# EAGLE schematic mainboard (EAGLE 6.6.0)

## Sheet 1 of 3: Avionics
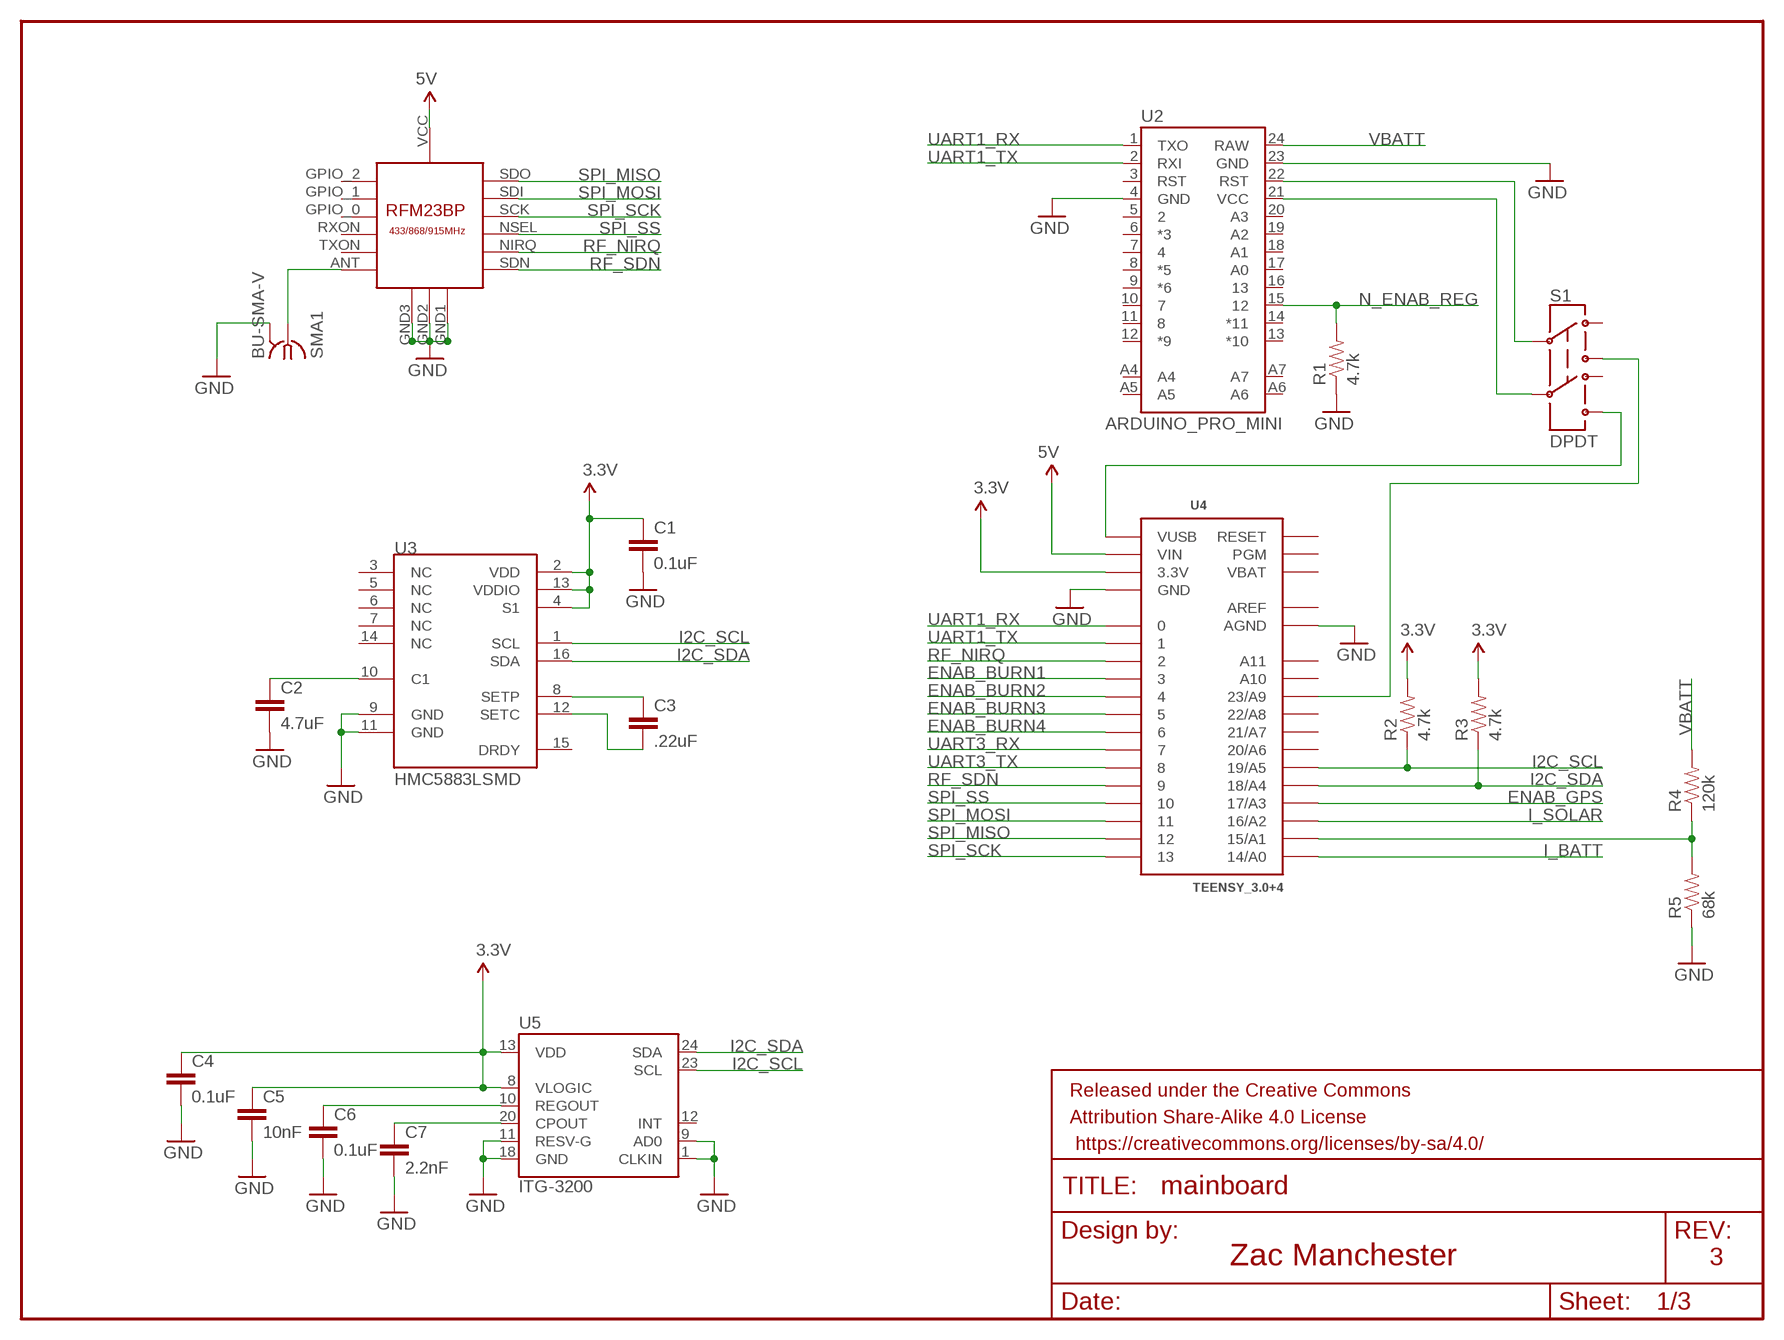
[diagram p0: schematic, sheet 1]

### Parts
C1  0.1uF  CAP0805  [0805]
C2  4.7uF  CAP0805  [0805]
C3  .22uF  CAP0805  [0805]
C4  0.1uF  CAP0805  [0805]
C5  10nF  CAP0805  [0805]
C6  0.1uF  CAP0805  [0805]
C7  2.2nF  CAP0805  [0805]
FRAME1  FRAME-LETTER  [CREATIVE_COMMONS]
R1  4.7k  RESISTOR0805-RES  [0805]
R2  4.7k  RESISTOR0805-RES  [0805]
R3  4.7k  RESISTOR0805-RES  [0805]
R4  120k  RESISTOR0805-RES  [0805]
R5  68k  RESISTOR0805-RES  [0805]
S1  DPDT  SWITCH-DPDTAYZ0202  [AYZ0202]
SMA1  BU-SMA-V  [BU-SMA-V]
U1  RFM23BP  [RFM23BP]
U2  ARDUINO_PRO_MINI  [ARDUINO_PRO_MINI]
U3  HMC5883LSMD  [16LPCC]
U4  TEENSY_3.0+4  [TEENSY_3.0+4]
U5  ITG-3200  [QFN-24]

### Nets
3.3V: C1.1 C4.1 C5.1 R2.2 R3.2 U3.2(VDD) U3.4(S1) U3.13(VDDIO) U4.3.3V U4.3.3V1(3.3V) U5.8(VLOGIC) U5.13(VDD) ; also sheet 2
5V: U1.VCC U4.VIN ; also sheet 2
ENAB_BURN1: U4.3 ; also sheet 2
ENAB_BURN2: U4.4 ; also sheet 2
ENAB_BURN3: U4.5 ; also sheet 2
ENAB_BURN4: U4.6 ; also sheet 2
ENAB_GPS: U4.17/A3 ; also sheet 2
GND: C1.2 C2.2 C4.2 C5.2 C6.2 C7.2 R1.1 R5.1 SMA1.2 SMA1.3 SMA1.4 SMA1.5 U1.GND1 U1.GND2 U1.GND3 U2.4(GND) U2.23(GND) U3.9(GND) U3.11(GND) U4.AGND U4.GND U4.GND1(GND) U5.1(CLKIN) U5.9(AD0) U5.11(RESV-G) U5.18(GND) ; also sheet 2,3
I2C_SCL: R2.1 U3.1(SCL) U4.19/A5 U5.23(SCL)
I2C_SDA: R3.1 U3.16(SDA) U4.18/A4 U5.24(SDA)
I_BATT: U4.14/A0 ; also sheet 2
I_SOLAR: U4.16/A2 ; also sheet 2
N$11: S1.3 U4.23/A9
N$13: S1.6 U4.VUSB
N$19: SMA1.1 U1.ANT
N$37: R4.1 R5.2 U4.15/A1
N$39: C7.1 U5.20(CPOUT)
N$40: C6.1 U5.10(REGOUT)
N$42: C2.1 U3.10(C1)
N$43: C3.1 U3.8(SETP)
N$44: C3.2 U3.12(SETC)
N_ENAB_REG: R1.2 U2.15 ; also sheet 2
PGM_RST: S1.2 U2.22(RST)
PGM_VCC: S1.5 U2.21(VCC)
RF_NIRQ: U1.NIRQ U4.2
RF_SDN: U1.SDN U4.9
SPI_MISO: U1.SDO U4.12
SPI_MOSI: U1.SDI U4.11
SPI_SCK: U1.SCK U4.13
SPI_SS: U1.NSEL U4.10
UART1_RX: U2.1(TXO) U4.0
UART1_TX: U2.2(RXI) U4.1
UART3_RX: U4.7 ; also sheet 3
UART3_TX: U4.8 ; also sheet 3
VBATT: R4.2 U2.24(RAW) ; also sheet 2,3
Unconnected: S1.1 S1.4 U1.GPIO_0 U1.GPIO_1 U1.GPIO_2 U1.RXON U1.TXON U2.3(RST) U2.5 U2.6(*3) U2.7 U2.8(*5) U2.9(*6) U2.10 U2.11 U2.12(*9) U2.13(*10) U2.14(*11) U2.16 U2.17(A0) U2.18(A1) U2.19(A2) U2.20(A3) U2.A4 U2.A5 U2.A6 U2.A7 U3.3(NC) U3.5(NC) U3.6(NC) U3.7(NC) U3.14(NC) U3.15(DRDY) U4.20/A6 U4.21/A7 U4.22/A8 U4.A10 U4.A11 U4.PGM U4.RESET U5.12(INT)

### Notes on the sheet
- Zac Manchester | 3

## Sheet 2 of 3: Power
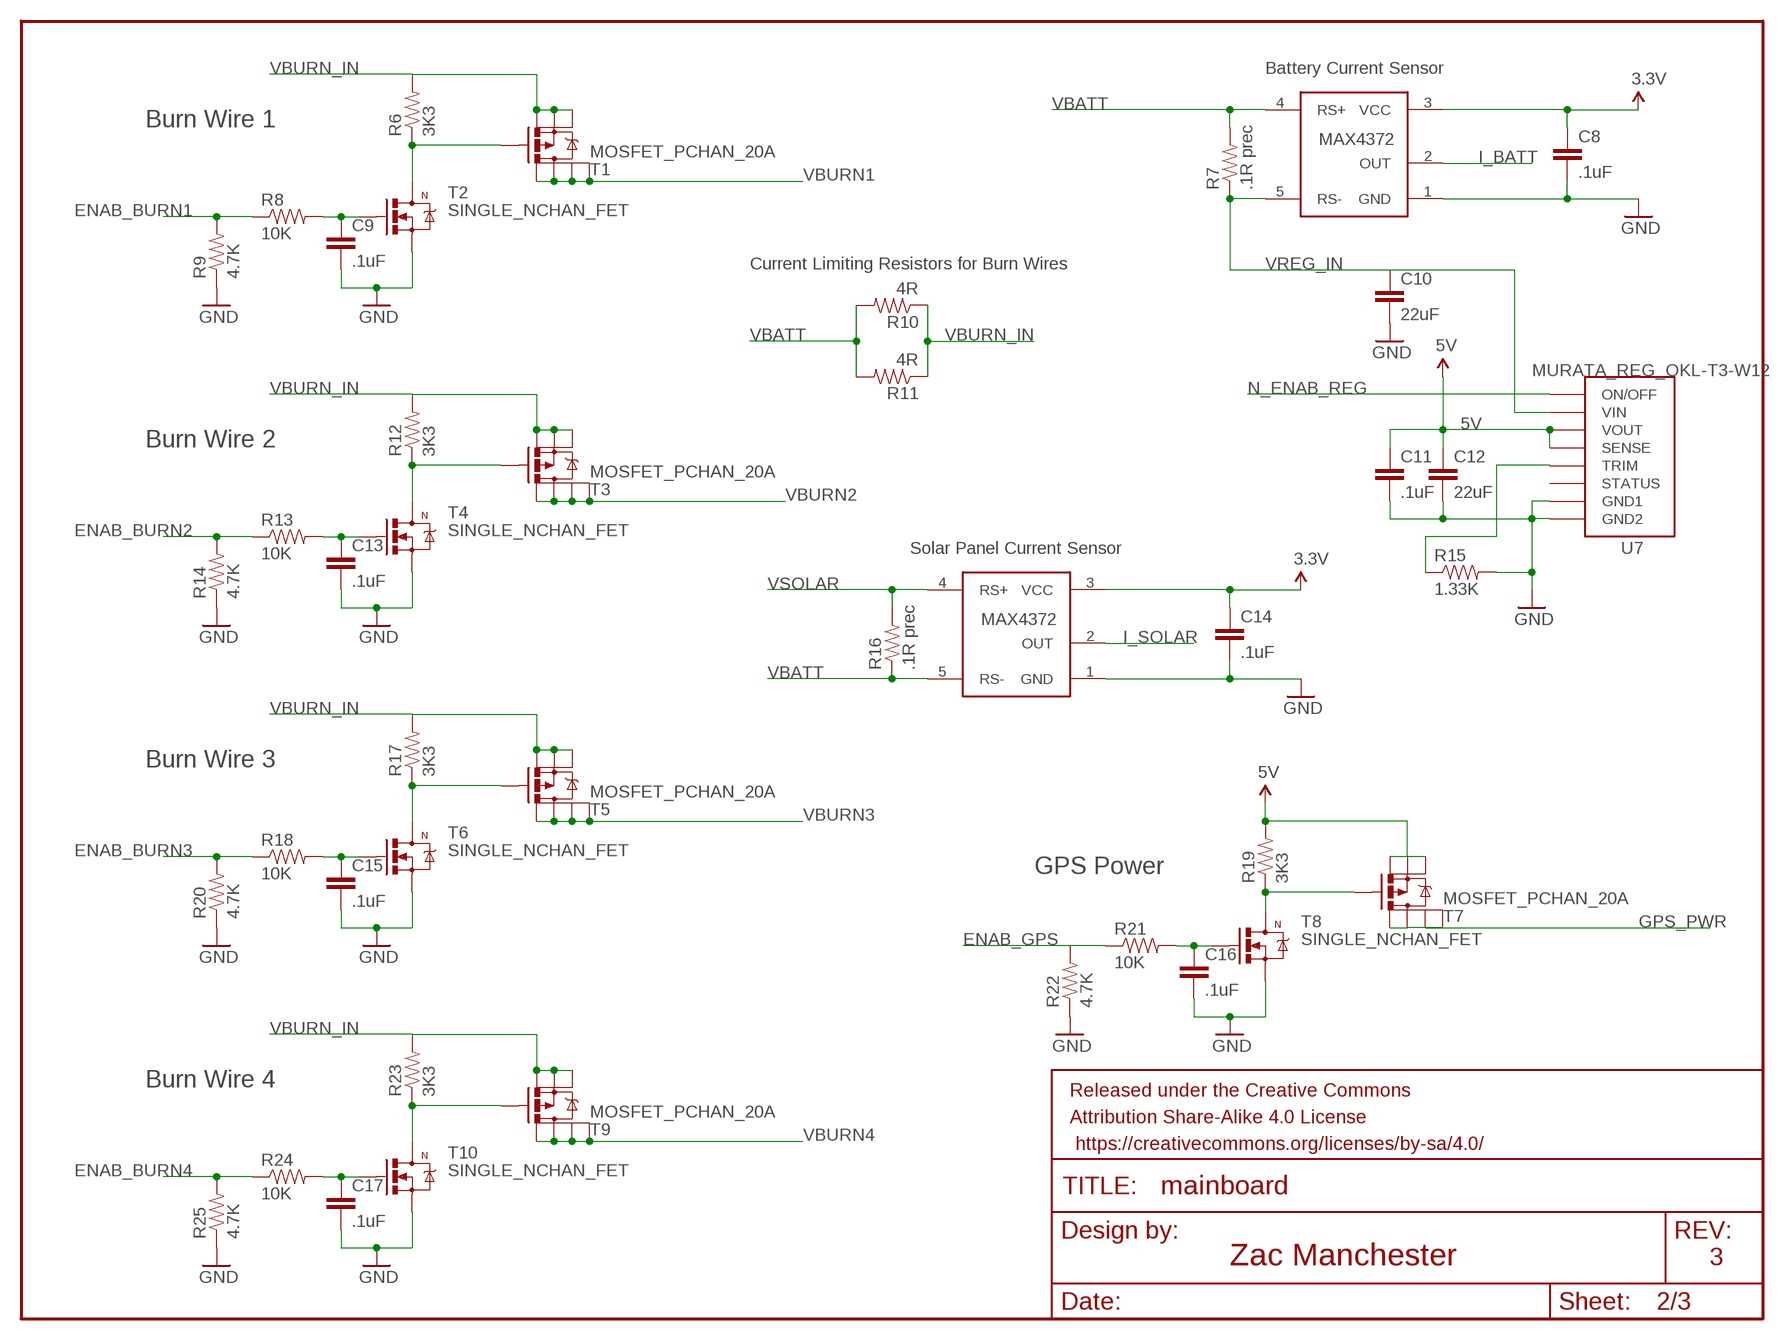
[diagram p1: schematic, sheet 2]

### Parts
C8  .1uF  CAP0805  [0805]
C9  .1uF  CAP0805  [0805]
C10  22uF  CAP1206  [1206]
C11  .1uF  CAP0805  [0805]
C12  22uF  CAP1206  [1206]
C13  .1uF  CAP0805  [0805]
C14  .1uF  CAP0805  [0805]
C15  .1uF  CAP0805  [0805]
C16  .1uF  CAP0805  [0805]
C17  .1uF  CAP0805  [0805]
FRAME2  FRAME-LETTER  [CREATIVE_COMMONS]
R6  3K3  RESISTOR0805-RES  [0805]
R7  .1R prec  RESISTOR0805-RES  [0805]
R8  10K  RESISTOR0805-RES  [0805]
R9  4.7K  RESISTOR0805-RES  [0805]
R10  4R  RESISTOR2512  [R2512]
R11  4R  RESISTOR2512  [R2512]
R12  3K3  RESISTOR0805-RES  [0805]
R13  10K  RESISTOR0805-RES  [0805]
R14  4.7K  RESISTOR0805-RES  [0805]
R15  1.33K  RESISTOR0805-RES  [0805]
R16  .1R prec  RESISTOR0805-RES  [0805]
R17  3K3  RESISTOR0805-RES  [0805]
R18  10K  RESISTOR0805-RES  [0805]
R19  3K3  RESISTOR0805-RES  [0805]
R20  4.7K  RESISTOR0805-RES  [0805]
R21  10K  RESISTOR0805-RES  [0805]
R22  4.7K  RESISTOR0805-RES  [0805]
R23  3K3  RESISTOR0805-RES  [0805]
R24  10K  RESISTOR0805-RES  [0805]
R25  4.7K  RESISTOR0805-RES  [0805]
T1  MOSFET_PCHAN_20A  [SO8]
T2  SINGLE_NCHAN_FET  [SOT23-3]
T3  MOSFET_PCHAN_20A  [SO8]
T4  SINGLE_NCHAN_FET  [SOT23-3]
T5  MOSFET_PCHAN_20A  [SO8]
T6  SINGLE_NCHAN_FET  [SOT23-3]
T7  MOSFET_PCHAN_20A  [SO8]
T8  SINGLE_NCHAN_FET  [SOT23-3]
T9  MOSFET_PCHAN_20A  [SO8]
T10  SINGLE_NCHAN_FET  [SOT23-3]
U6  CURRENT_MAX4372  [SOT23-5]
U7  MURATA_REG_OKL-T3-W12  MURATA_REG_OKL-T6-W12  [MURATA_REG_OKL-T6-W12]
U8  CURRENT_MAX4372  [SOT23-5]

### Nets
3.3V: C8.1 C14.1 U6.3(VCC) U8.3(VCC) ; also sheet 1
5V: C11.1 C12.1 R19.2 T7.1(S) T7.2(S) T7.3(S) U7.4(VOUT) U7.5(SENSE) ; also sheet 1
ENAB_BURN1: R8.1 R9.2 ; also sheet 1
ENAB_BURN2: R13.1 R14.2 ; also sheet 1
ENAB_BURN3: R18.1 R20.2 ; also sheet 1
ENAB_BURN4: R24.1 R25.2 ; also sheet 1
ENAB_GPS: R21.1 R22.2 ; also sheet 1
GND: C8.2 C9.2 C10.2 C11.2 C12.2 C13.2 C14.2 C15.2 C16.2 C17.2 R9.1 R14.1 R15.2 R20.1 R22.1 R25.1 T2.2(S) T4.2(S) T6.2(S) T8.2(S) T10.2(S) U6.1(GND) U7.3(GND1) U7.7(GND2) U8.1(GND) ; also sheet 1,3
GPS_PWR: T7.5(D) T7.6(D) T7.7(D) T7.8(D) ; also sheet 3
I_BATT: U6.2(OUT) ; also sheet 1
I_SOLAR: U8.2(OUT) ; also sheet 1
N$2: C13.1 R13.2 T4.1(G)
N$3: R12.1 T3.4(G) T4.3(D)
N$5: C15.1 R18.2 T6.1(G)
N$6: R17.1 T5.4(G) T6.3(D)
N$7: R15.1 U7.6(TRIM)
N$8: C17.1 R24.2 T10.1(G)
N$9: R23.1 T9.4(G) T10.3(D)
N$10: C16.1 R21.2 T8.1(G)
N$12: R19.1 T7.4(G) T8.3(D)
N$21: C9.1 R8.2 T2.1(G)
N$24: R6.1 T1.4(G) T2.3(D)
N_ENAB_REG: U7.1(ON/OFF) ; also sheet 1
VBATT: R7.2 R10.2 R11.2 R16.1 U6.4(RS+) U8.5(RS-) ; also sheet 1,3
VBURN1: T1.5(D) T1.6(D) T1.7(D) T1.8(D) ; also sheet 3
VBURN2: T3.5(D) T3.6(D) T3.7(D) T3.8(D) ; also sheet 3
VBURN3: T5.5(D) T5.6(D) T5.7(D) T5.8(D) ; also sheet 3
VBURN4: T9.5(D) T9.6(D) T9.7(D) T9.8(D) ; also sheet 3
VBURN_IN: R6.2 R10.1 R11.1 R12.2 R17.2 R23.2 T1.1(S) T1.2(S) T1.3(S) T3.1(S) T3.2(S) T3.3(S) T5.1(S) T5.2(S) T5.3(S) T9.1(S) T9.2(S) T9.3(S)
VREG_IN: C10.1 R7.1 U6.5(RS-) U7.2(VIN)
VSOLAR: R16.2 U8.4(RS+) ; also sheet 3
Unconnected: U7.10(STATUS)

### Notes on the sheet
- Battery Current Sensor
- Burn Wire 1
- Current Limiting Resistors for Burn Wires
- Burn Wire 2
- Solar Panel Current Sensor
- Burn Wire 3
- GPS Power
- Burn Wire 4
- Zac Manchester | 3

## Sheet 3 of 3: Connectors
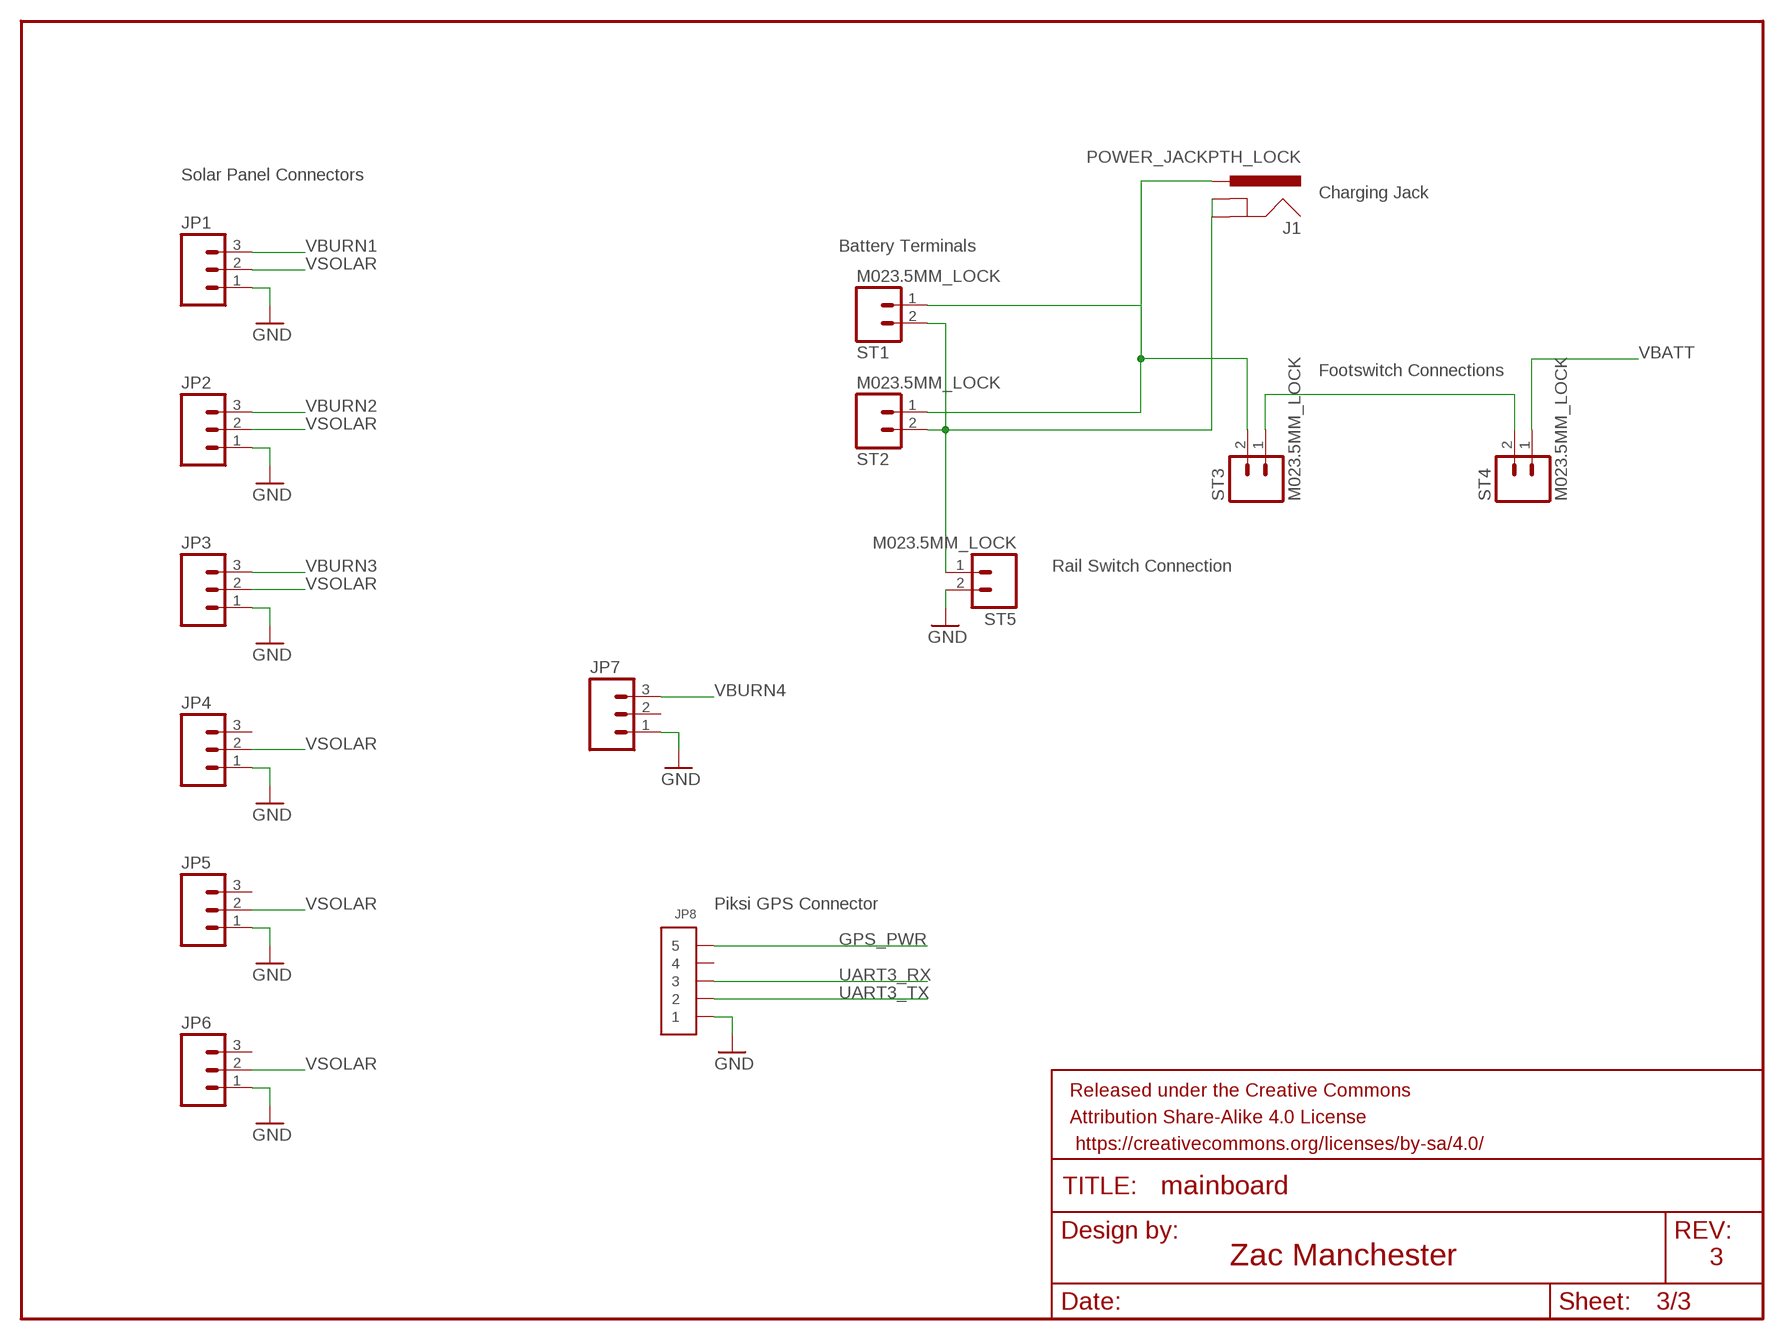
[diagram p2: schematic, sheet 3]

### Parts
FRAME3  FRAME-LETTER  [CREATIVE_COMMONS]
J1  POWER_JACKPTH_LOCK  [POWER_JACK_PTH_LOCK]
JP1  M03POLAR_LOCK  [MOLEX-1X3_LOCK]
JP2  M03POLAR_LOCK  [MOLEX-1X3_LOCK]
JP3  M03POLAR_LOCK  [MOLEX-1X3_LOCK]
JP4  M03POLAR_LOCK  [MOLEX-1X3_LOCK]
JP5  M03POLAR_LOCK  [MOLEX-1X3_LOCK]
JP6  M03POLAR_LOCK  [MOLEX-1X3_LOCK]
JP7  M03POLAR_LOCK  [MOLEX-1X3_LOCK]
JP8  CONN_5-1-53261  [PB-53261-05]
ST1  M023.5MM_LOCK  [SCREWTERMINAL-3.5MM-2_LOCK]
ST2  M023.5MM_LOCK  [SCREWTERMINAL-3.5MM-2_LOCK]
ST3  M023.5MM_LOCK  [SCREWTERMINAL-3.5MM-2_LOCK]
ST4  M023.5MM_LOCK  [SCREWTERMINAL-3.5MM-2_LOCK]
ST5  M023.5MM_LOCK  [SCREWTERMINAL-3.5MM-2_LOCK]

### Nets
BATT_INPUT: J1.PWR ST1.1 ST2.1 ST3.2
GND: JP1.1 JP2.1 JP3.1 JP4.1 JP5.1 JP6.1 JP7.1 JP8.1 ST5.2 ; also sheet 1,2
GPS_PWR: JP8.5 ; also sheet 2
N$1: J1.GND J1.GNDBREAK ST1.2 ST2.2 ST5.1
N$4: ST3.1 ST4.2
UART3_RX: JP8.3 ; also sheet 1
UART3_TX: JP8.2 ; also sheet 1
VBATT: ST4.1 ; also sheet 1,2
VBURN1: JP1.3 ; also sheet 2
VBURN2: JP2.3 ; also sheet 2
VBURN3: JP3.3 ; also sheet 2
VBURN4: JP7.3 ; also sheet 2
VSOLAR: JP1.2 JP2.2 JP3.2 JP4.2 JP5.2 JP6.2 ; also sheet 2
Unconnected: JP4.3 JP5.3 JP6.3 JP7.2 JP8.4

### Notes on the sheet
- Solar Panel Connectors
- Charging Jack
- Battery Terminals
- Footswitch Connections
- Rail Switch Connection
- Piksi GPS Connector
- Zac Manchester | 3

## Power pins joined to a net without a drawn wire
AREF: U4.AREF
VBAT: U4.VBAT

## Library data of the parts
C1-C17 = SparkFun-Capacitors:CAP: Capacitor Standard 0603 ceramic capacitor, and 0.1" leaded capacitor.
FRAME1-FRAME3 = SparkFun-Aesthetics:FRAME-LETTER: Schematic Frame Standard 8.5x11 US Letter frame
J1 = SparkFun-Connectors:POWER_JACK: Power Jack This is the standard 5.5mm barrel jack for power. The PTH is the most common, proven, reliable, footprint. The Slot footprint only works if the mill layer is transmitted to the PCB fab house so be warned. Mating wall wart : TOL-00298 (and others); PROD_ID: PRT-00119
JP1-JP7 = SparkFun-Connectors:M03: Header 3 Standard 3-pin 0.1" header. Use with straight break away headers (SKU : PRT-00116), right angle break away headers (PRT-00553), swiss pins (PRT-00743), machine pins (PRT-00117), and female headers (PRT-00115). Molex polarized connector foot print use with SKU : PRT-08232 with associated crimp pins and housings.
JP8 = pel_molex:CONN_5-1
R1-R25 = SparkFun-Resistors:RESISTOR: Resistor Basic schematic elements and footprints for 0603, 1206, and PTH resistors.
S1 = SparkFun-Electromechanical:SWITCH-DPDT: DPDT Version of the COM-00597; PROD_ID: SWCH-08179
SMA1 = con-coax:BU-SMA-V: FEMALE SMA CONNECTOR Radiall distributor RS 112-3794; OC_FARNELL: unknown; OC_NEWARK: unknown
ST1-ST5 = SparkFun-Connectors:M02: Standard 2-pin 0.1" header. Use with - straight break away headers ( PRT-00116) - right angle break away headers (PRT-00553) - swiss pins (PRT-00743) - machine pins (PRT-00117) - female headers (PRT-00115) Molex polarized connector foot print use with: PRT-08233 with associated crimp pins and housings. 2.54_SCREWTERM for use with PRT-10571. 3.5mm Screw Terminal footprints for PRT-08084 5mm Screw Terminal footprints for use with PRT-08433
T1 T3 T5 T7 T9 = phonesat:MOSFET_PCHAN_20A
T2 T4 T6 T8 T10 = phonesat:SINGLE_NCHAN_FET
U1 = RFM23BP:RFM23BP: HopeRF RFM23BP Library by: http://projects.weber-itam.de
U2 = SparkFun-Boards:ARDUINO_PRO_MINI
U3 = SparkFun-Sensors:HMC5883L: 3 Axis Digital Compass IC
U4 = Teensy3.0:TEENSY_3.0+4: Teensy 3.0 board, showing all pins that are easily acessible. See 'AllAnalogPins" and 'AllPins' packages for additional pin holes, as needed. The 'Basic' package has fewer pins.
U5 = SparkFun-Sensors:ITG-3200: ITG-3200 3-axis gyro, digital output, qfn24 package
U6 U8 = phonesat:CURRENT_MAX4372
U7 = phonesat:MURATA_REG_OKL-T6-W12